# Altium schematic sheet [20]-CONNECT_CONNECTORS.SchDoc
size A4
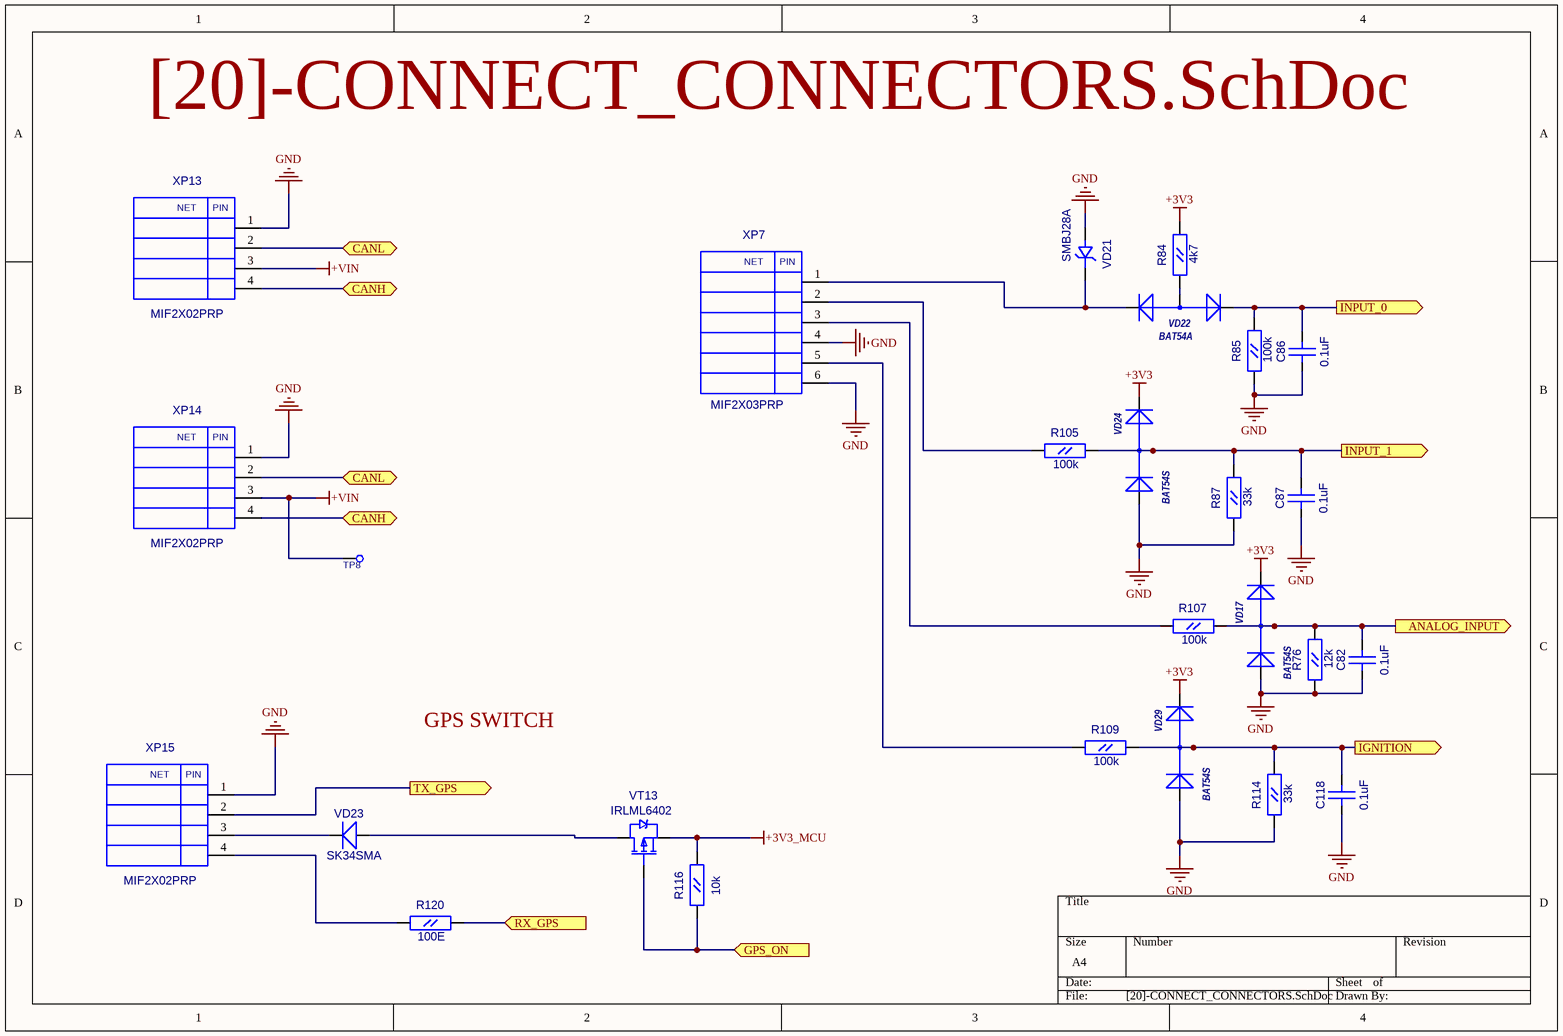
[diagram p0: [20]-CONNECT_CONNECTORS.SchDoc]

## Parts
C82  0.1uF  [CC0603]
C86  0.1uF  [CC0603]
C87  0.1uF  [CC0603]
C118  0.1uF  [CC0603]
R76  12k  [RC0603]
R84  4k7  [RC0603]
R85  100k  [RC0603]
R87  33k  [RC0603]
R105  100k  [RC0603]
R107  100k  [RC0603]
R109  100k  [RC0603]
R114  33k  [RC0603]
R116  10k  [RC0603]
R120  100E  [RC0603]
TP8  TESTPOINT1  [TESTPOINT1]  (value not drawn)
VD17  BAT54S  [SOT-23(GSD)]
VD21  SMBJ28A  [SMB]
VD22  BAT54A  [SOT-23(123)]
VD23  SK34SMA  [SMA]
VD24  BAT54S  [SOT-23(GSD)]
VD29  BAT54S  [SOT-23(GSD)]
VT13  IRLML6402  [SOT-23(123)]
XP7  MIF2X03PRP  [MIF2X03PRP]
XP13  MIF2X02PRP  [MIF2X02PRP]
XP14  MIF2X02PRP  [MIF2X02PRP]
XP15  MIF2X02PRP  [MIF2X02PRP]

## Ports
ANALOG_INPUT (out), CANH (bidir), CANL (bidir), GPS_ON (in), IGNITION (out), INPUT_0 (out), INPUT_1 (out), RX_GPS (in), TX_GPS (out)

## Nets
+3V3: R84.2(B) VD17.2(K) VD24.2(K) VD29.2(K)
+3V3_MCU: R116.2(B) VT13.2(S)
+VIN: TP8.1 XP13.3 XP14.3
GND: C82.1(A) C86.1(A) C87.1(A) C118.1(A) R76.1(A) R85.1(A) R87.1(A) R114.1(A) VD17.1(A) VD21.1(A) VD24.1(A) VD29.1(A) XP7.4 XP7.6 XP13.1 XP14.1 XP15.1
ANALOG_INPUT: C82.2(B) R76.2(B) R107.2(B) VD17.3(AK) ; port ANALOG_INPUT
CANH: XP13.4 XP14.4 ; port CANH
CANL: XP13.2 XP14.2 ; port CANL
GPS_ON: R116.1(A) VT13.1(G) ; port GPS_ON
IGNITION: C118.2(B) R109.2(B) R114.2(B) VD29.3(AK) ; port IGNITION
INPUT_0: C86.2(B) R85.2(B) VD22.2(K) ; port INPUT_0
INPUT_1: C87.2(B) R87.2(B) R105.2(B) VD24.3(AK) ; port INPUT_1
RX_GPS: R120.2(B) ; port RX_GPS
TX_GPS: XP15.2 ; port TX_GPS
NetR84_1: R84.1(A) VD22.3(A)
NetR105_1: R105.1(A) XP7.2
NetR107_1: R107.1(A) XP7.3
NetR109_1: R109.1(A) XP7.5
NetR120_1: R120.1(A) XP15.4
NetVD21_2: VD21.2(K) VD22.1(K) XP7.1
NetVD23_1: VD23.1(A) VT13.3(D)
NetVD23_2: VD23.2(K) XP15.3

## Notes on the sheet
- GPS SWITCH
- (in symbol MIF2X02PRP) NET; PIN
- (in symbol MIF2X03PRP) NET; PIN

## Library data of the parts
C82 C86 C87 C118 = CC0603: Value: 0.1uF
R76 R84 R85 R87 R105 R107 R109 R114 R116 R120 = RC0603
  R76: Value: 12k
  R84: Value: 4k7
  R85 R105 R107 R109: Value: 100k
  R87 R114: Value: 33k
  R116: Value: 10k
  R120: Value: 100E
VD17 VD24 VD29 = BAT54S: 1.0 Ampere General Purpose Rectifier; ComponentField6: Published 8-Jun-2000, Modified 11-July-2000: SIM Model Added.; Value: *
VD21 = SMBJ: Value: SMBJ28A
VD22 = BAT54A: 1.0 Ampere General Purpose Rectifier; ComponentField6: Published 8-Jun-2000, Modified 11-July-2000: SIM Model Added.; Value: *
VD23 = SK34SMA: Schottky Rectifier; Value: {Value}
VT13 = IRLML6402: HEXFET Power MOSFET; OriginalName: IRLML5103; ComponentField7: Published 8-Jun-2000; Value: IRLML6402
TP8 = TESTPOINT1: Value: *
XP7 = MIF2X03PRP: Value: *
XP13-XP15 = MIF2X02PRP: Value: *